# EAGLE design g5gate-min132 (EAGLE 9.6.2)
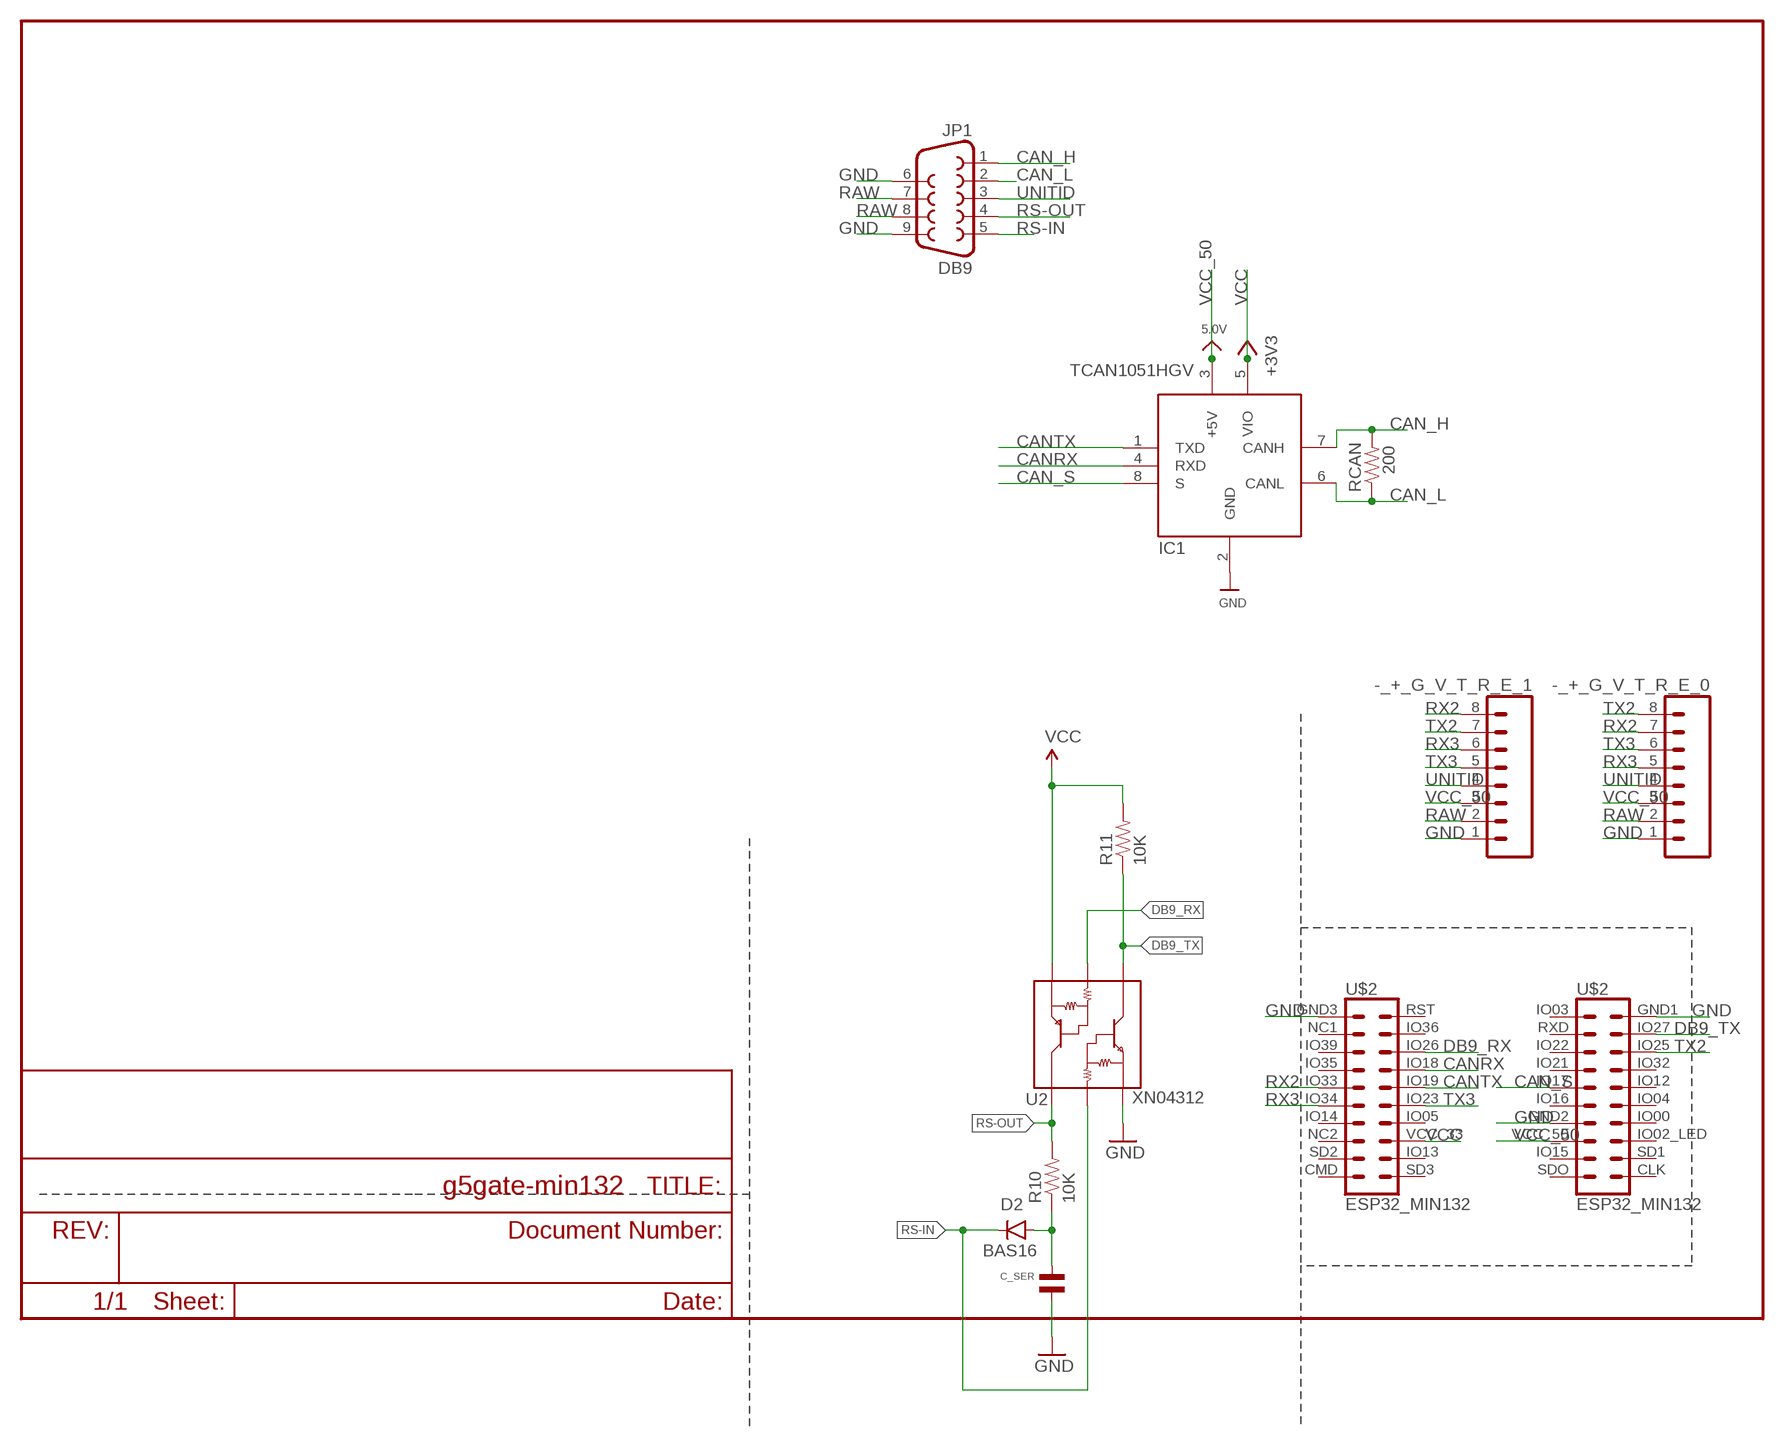
[diagram p0: schematic, sheet 1]

## Parts
-_+_G_V_T_R_E_0  MF-CON-2.54mm-01x08  M081X08  [1X08]
-_+_G_V_T_R_E_1  MF-CON-2.54mm-01x08  M081X08  [1X08]
C_SER  CAPACITOR_NP_0603  [C0603]
D2  BAS16  DIODEBAS16  [SOD-323]
IC1  TCAN1051HGV  CAN_TRANSCIEVER_TCAN1051V  [SOIC8_150MIL]
JP1  DB9  DB9FEMALE  [DB9]
R10  10K  10KOHM1/10W1%(0603)0603  [0603-RES]
R11  10K  10KOHM1/10W1%(0603)0603  [0603-RES]
RCAN  200  10KOHM1/10W1%(0603)0603  [0603-RES]
U2  XN04312  XN04312SOT  [SOT23-6]
U$2  ESP32_MIN132  [ESP32_MIN132]

## Nets
CAN_H: IC1.7(CANH) JP1.1 RCAN.2
CAN_L: IC1.6(CANL) JP1.2 RCAN.1
CAN_S: IC1.8(S) U$2.IO17
CANRX: IC1.4(RXD) U$2.IO18
CANTX: IC1.1(TXD) U$2.IO19
DB9_RX: U2.2(B2) U$2.IO26
DB9_TX: R11.1 U2.1(C1) U$2.IO27
GND [hc]: -_+_G_V_T_R_E_0.1 -_+_G_V_T_R_E_1.1 C_SER.P$2 IC1.2(GND) JP1.6 JP1.9 U2.6(E1) U$2.GND1 U$2.GND2 U$2.GND3
N$4: C_SER.P$1 D2.A R10.1
RAW: -_+_G_V_T_R_E_0.2 -_+_G_V_T_R_E_1.2 JP1.7 JP1.8
RS-IN: D2.C JP1.5 U2.5(B1)
RS-OUT: JP1.4 R10.2 U2.4(C2)
RX2: -_+_G_V_T_R_E_0.7 -_+_G_V_T_R_E_1.8 U$2.IO33
RX3: -_+_G_V_T_R_E_0.5 -_+_G_V_T_R_E_1.6 U$2.IO34
TX2: -_+_G_V_T_R_E_0.8 -_+_G_V_T_R_E_1.7 U$2.IO25
TX3: -_+_G_V_T_R_E_0.6 -_+_G_V_T_R_E_1.5 U$2.IO23
UNITID: -_+_G_V_T_R_E_0.4 -_+_G_V_T_R_E_1.4 JP1.3
VCC [hc]: IC1.5(VIO) R11.2 U2.3(E2) U$2.VCC_33 ; supply symbol labelled +3V3
VCC_50 [hc]: -_+_G_V_T_R_E_0.3 -_+_G_V_T_R_E_1.3 IC1.3(+5V) U$2.VCC_50 ; supply symbol labelled 5.0V
Unconnected: U$2.CLK U$2.CMD U$2.IO00 U$2.IO02_LED U$2.IO03 U$2.IO04 U$2.IO05 U$2.IO12 U$2.IO13 U$2.IO14 U$2.IO15 U$2.IO16 U$2.IO21 U$2.IO22 U$2.IO32 U$2.IO35 U$2.IO36 U$2.IO39 U$2.NC1 U$2.NC2 U$2.RST U$2.RXD U$2.SD1 U$2.SD2 U$2.SD3 U$2.SDO

## Library data of the parts
-_+_G_V_T_R_E_0 -_+_G_V_T_R_E_1 = SparkFun-Connectors:M08: Header 8 Standard 8-pin 0.1" header. Use with straight break away headers (SKU : PRT-00116), right angle break away headers (PRT-00553), swiss pins (PRT-00743), machine pins (PRT-00117), and female headers (PRT-00115).
C_SER = MF_Passives:CAPACITOR_NP: Library: MF_Passives Description: Device for Non-Polarized Capacitors. Manufacture part number (MPN) can be added via Attributes. Check https://factory.macrofab.com/parts for the house parts list.; POPULATE: 1
D2 = SparkFun-DiscreteSemi:DIODE: Diode These are standard reverse protection diodes and small signal diodes. SMA package can handle up to about 1A. SOD-323 can handle about 200mA. What the SOD-323 package when ordering, there are some mfgs out there that are 5-pin packages.; PROD_ID: DIO-09646; VALUE: 250mA/100V
IC1 = microbuilder:CAN_TRANSCIEVER
JP1 = SparkFun-Connectors:DB9: DB9 Connector Standard DB9 (D-Sub 9) serial connector. Can be used for CAN bus as well as RS485 and RS232. Footprint production proven. Spark Fun Electronics SKU : PRT-00429; PROD_ID: CONN-08194
R10 R11 = SparkFun-Resistors:10KOHM1/10W1%(0603): RES-00824; PROD_ID: RES-00824
RCAN = SparkFun-Resistors:10KOHM1/10W1%(0603): RES-00824; PROD_ID: RES-00824; VALUE: 10K
U2 = SparkFun-DiscreteSemi:XN04312: NPN/PNP Transistor Array Handy dandy transistor array for level shifting and inverting signals. Spark Fun Electronics SKU : COM-00588; PROD_ID: TRANS-00816
U$2 = 01jim:ESP32_MIN132

## Net classes
0 default: width 0.229 mm
1 vcc: width 0.254 mm
3 hc: width 0.254 mm

## Board
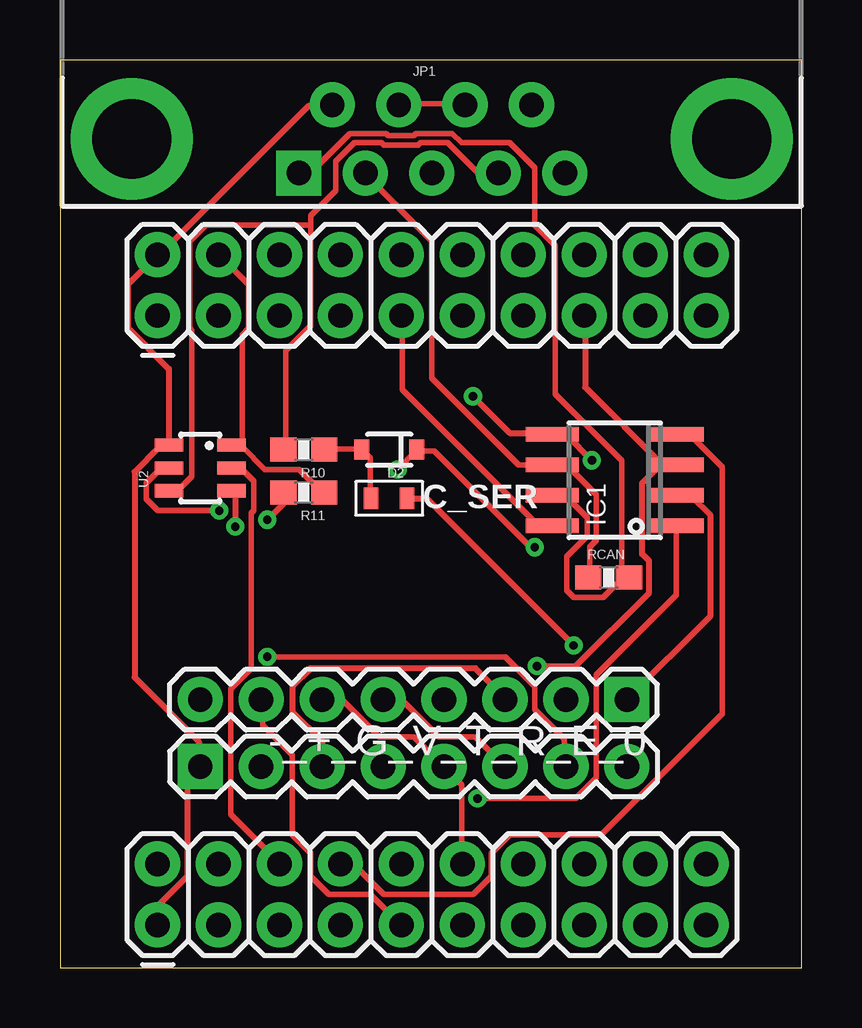
[diagram p1: board, top side]
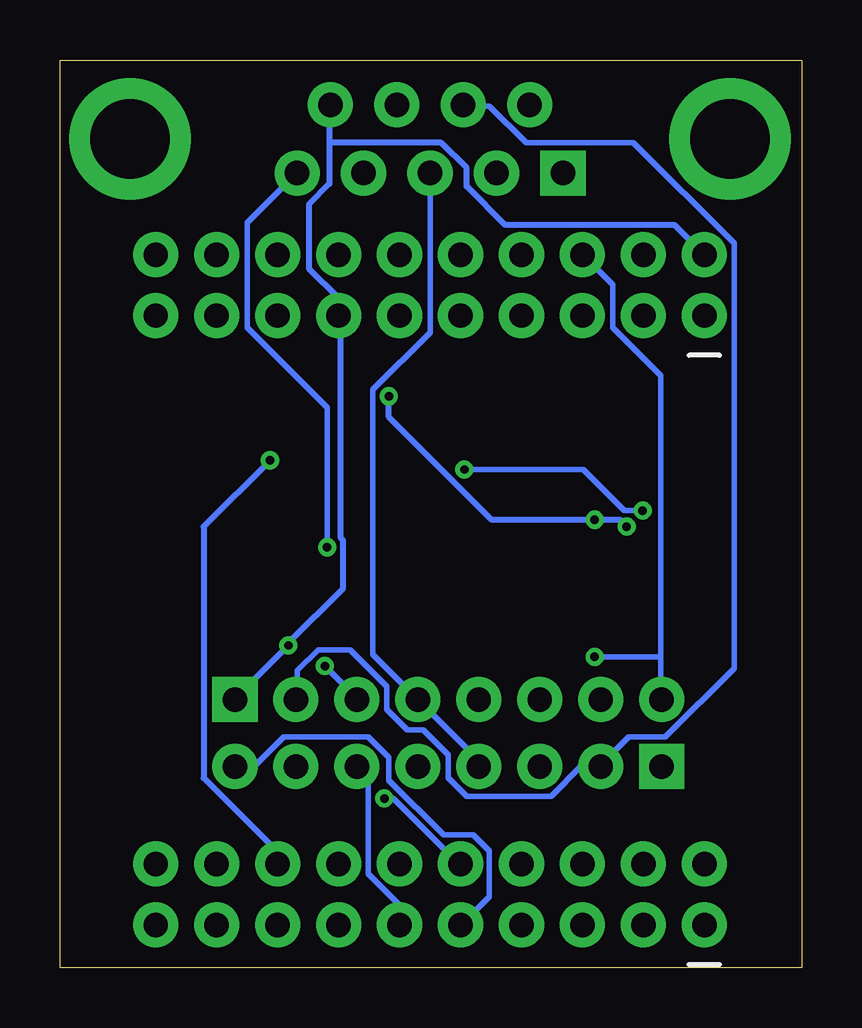
[diagram p2: board, bottom side, seen from below]

Size 30.91 x 37.84 mm. Coordinates in mm from the lower left corner, seen from the top.
Outline: 0,0 30.91,0 30.91,37.84 0,37.84 0,0
Copper layers (1*16): Top 0.035mm / dielectric 1.5mm / Bottom 0.035mm
Design rules "default *": minimum track width 6mil, minimum drill 0.35mm, track to track 6mil, track to pad 6mil, pad to pad 6mil, via to via 6mil, smd to smd 6mil, copper to edge 40mil, drill to drill 6mil, minimum pad ring 10mil, minimum via ring 8mil, stop-mask expansion 4mil, vias tented up to drill 30mil, thermal gap 10mil

### Footprints (pad centres in the part's own frame; a part is rotated, then mirrored left to right if it is on the bottom)
1X08 = drill 1.016 pad 1.88 square: 1 0,0 | drill 1.016 pad 1.88: 2 2.54,0; 3 5.08,0; 4 7.62,0; 5 10.16,0; 6 12.7,0; 7 15.24,0; 8 17.78,0
C0603 = smd 0.6 x 0.9: P$1 -0.75,0; P$2 0.75,0
SOD-323 = smd 0.63 x 0.83: A 1.15,0; C -1.15,0
SOIC8_150MIL = smd 0.6 x 2.2: 1 -1.905,-2.6; 2 -0.635,-2.6; 3 0.635,-2.6; 4 1.905,-2.6; 5 1.905,2.6; 6 0.635,2.6; 7 -0.635,2.6; 8 -1.905,2.6
DB9 = drill 1.016 pad 1.88 square: 1 -5.54,-1.42 | drill 1.016 pad 1.88: 2 -2.77,-1.42; 3 0,-1.42; 4 2.77,-1.42; 5 5.54,-1.42; 6 -4.15,1.42; 7 -1.38,1.42; 8 1.38,1.42; 9 4.15,1.42 | drill 3.302 pad 5.08: G1 -12.5,0; G2 12.5,0
0603-RES = smd 1.1 x 1: 1 -0.85,0; 2 0.85,0
SOT23-6 = smd 0.55 x 1.2: 1 0.95,-1.3; 2 0,-1.3; 3 -0.95,-1.3; 4 -0.95,1.3; 5 0,1.3; 6 0.95,1.3
ESP32_MIN132 = drill 1.016 pad 1.88: CLK 15.24,-22.86; CMD -12.7,-22.86; GND1 15.24,0; GND2 12.7,-15.24; GND3 -12.7,0; IO00 15.24,-15.24; IO02_LED 15.24,-17.78; IO03 12.7,0; IO04 15.24,-12.7; IO05 -10.16,-15.24; IO12 15.24,-10.16; IO13 -10.16,-20.32; IO14 -12.7,-15.24; IO15 12.7,-20.32; IO16 12.7,-12.7; IO17 12.7,-10.16; IO18 -10.16,-7.62; IO19 -10.16,-10.16; IO21 12.7,-7.62; IO22 12.7,-5.08; IO23 -10.16,-12.7; IO25 15.24,-5.08; IO26 -10.16,-5.08; IO27 15.24,-2.54; IO32 15.24,-7.62; IO33 -12.7,-10.16; IO34 -12.7,-12.7; IO35 -12.7,-7.62; IO36 -10.16,-2.54; IO39 -12.7,-5.08; NC1 -12.7,-2.54; NC2 -12.7,-17.78; RST -10.16,0; RXD 12.7,-2.54; SD1 15.24,-20.32; SD2 -12.7,-20.32; SD3 -10.16,-22.86; SDO 12.7,-22.86; VCC_33 -10.16,-17.78; VCC_50 12.7,-17.78

### Placement (x,y rotation side)
-_+_G_V_T_R_E_0  23.62,11.18 180 top
-_+_G_V_T_R_E_1  5.84,8.38 0 top
C_SER  13.72,19.56 0 top
D2  13.72,21.59 180 top
IC1  23.11,20.32 90 top
JP1  15.49,34.54 0 top
R10  10.16,21.59 180 top
R11  10.16,19.81 180 top
RCAN  22.86,16.26 0 top
U2  5.84,20.83 90 top
U$2  4.06,14.48 90 top

### Tracks (layer width: path | path; a pad name or v marks a point on that pad's centre or on a via)
CAN_H
  Top 0.229: IC1.7 20.54,19.62 21.11,19.62 21.97,18.76 21.97,18 21.11,17.14 21.11,15.72 21.4,15.43 22.64,15.43 23.4,16.19 23.69,16.19 RCAN.2 23.4,16.29 23.4,21.14 20.64,23.91 20.64,30.1 19.78,30.96 19.78,33.34 18.73,34.39 16.73,34.39 16.35,34.77 14.83,34.77 14.73,34.67 13.68,34.67 13.59,34.77 12.07,34.77 10.45,33.15 9.97,33.15 JP1.1
CAN_L
  Top 0.229: RCAN.1 22.07,16.29 22.07,17.53 22.35,17.81 22.35,19.72 21.11,20.96 IC1.6 19.11,20.96 15.49,24.57 15.49,30.29 12.73,33.05 JP1.2
CAN_S
  Top 0.229: IC1.8 20.45,18.48 19.88,18.48 14.26,24.1 14.26,27.15 U$2.IO17
CANRX
  Top 0.229: IC1.4 25.78,22.19 26.26,22.19 27.59,20.86 27.59,10.57 22.54,5.52 18.73,5.52 17.97,4.76 17.97,3.81 17.21,3.05 13.49,3.05 12.26,4.29 11.68,4.29 U$2.IO18
CANTX  (via drill 0.35)
  Top 0.229: v17.4,7.05 21.5,7.05 22.35,7.91 22.35,12.19 25.69,15.53 25.69,18.38 IC1.1
  Bottom 0.229: v17.4,7.05 17.02,7.05 14.26,4.29 U$2.IO19
DB9_RX
  Top 0.229: U2.2 7.21,20.76 7.59,20.76 8.07,20.29 8.07,19.05 7.97,18.96 7.97,12.48 7.11,11.62 7.11,6.38 9.11,4.38 U$2.IO26
DB9_TX
  Top 0.229: R11.1 10.92,19.81 9.97,20.76 8.54,20.76 7.59,21.72 7.21,21.72 U2.1 7.59,21.81 7.59,26.38 7.87,26.67 7.87,28.48 6.64,29.72 U$2.IO27
GND  (via drill 0.35)
  Top 0.254: v21.4,13.43 15.3,19.53 14.54,19.53 C_SER.P$2 | -_+_G_V_T_R_E_0.1 27.11,14.67 27.11,18.86 26.35,19.62 25.78,19.62 IC1.2 | U$2.GND3 4.06,2.57 5.3,3.81 5.3,7.91 5.78,8.38 -_+_G_V_T_R_E_1.1 5.78,8.48 5.78,9.43 3.11,12.1 3.11,20.67 4.16,21.72 4.45,21.72 U2.6 4.54,21.81 4.54,24.96 2.83,26.67 2.83,28.48 U$2.GND1 4.16,29.72 10.35,35.91 11.3,35.91 JP1.6
  Bottom 0.254: 19.68,34.39 19.68,35.91 JP1.9 | 19.68,34.39 19.68,32.67 20.54,31.81 20.54,29.15 19.3,27.91 U$2.GND2 19.21,27.15 19.21,17.91 19.11,17.81 19.11,15.81 21.4,13.52 v21.4,13.43 23.59,11.24 -_+_G_V_T_R_E_0.1 | 19.68,34.39 15.02,34.39 13.97,33.34 13.97,32.58 12.35,30.96 5.3,30.96 U$2.GND1
N$4
  Top 0.229: R10.1 11.02,21.62 12.54,21.62 D2.A 12.64,21.53 12.92,21.24 12.92,19.62 C_SER.P$1
RAW
  Top 0.229: JP1.7 14.16,36 16.83,36 JP1.8
  Bottom 0.229: -_+_G_V_T_R_E_0.2 21.02,11.24 21.02,12.38 20.16,13.24 18.83,13.24 17.3,11.72 17.3,10.76 16.45,9.91 15.78,9.91 14.73,8.86 14.73,7.91 13.97,7.14 10.45,7.14 9.21,8.38 -_+_G_V_T_R_E_1.2 8.35,8.48 7.21,9.62 5.68,9.62 2.83,12.48 2.83,30.19 7.02,34.39 11.49,34.39 13.02,35.91 14.07,35.91 JP1.7
RS-IN  (via drill 0.35)
  Top 0.229: v19.78,17.53 19.59,17.53 15.59,21.53 14.92,21.53 D2.C 14.83,21.53 v14.07,20.76 | v6.64,19.05 4.06,19.05 3.59,19.53 3.59,20.19 4.16,20.76 4.54,20.76 U2.5
  Bottom 0.229: v19.78,17.53 19.78,23.34 23.11,26.67 23.11,31.05 21.11,33.05 JP1.5 | v6.64,19.05 7.4,19.05 9.11,20.76 v14.07,20.76
RS-OUT
  Top 0.229: 10.45,30.96 10.45,31.34 11.49,32.39 11.49,33.62 12.26,34.39 13.4,34.39 13.49,34.29 14.92,34.29 15.02,34.39 16.16,34.39 17.4,33.15 18.26,33.15 JP1.4 | 10.45,30.96 10.45,26.76 9.4,25.72 9.4,21.62 R10.2 | 10.45,30.96 6.06,30.96 5.4,30.29 5.4,26.67 5.49,26.57 5.49,20.48 4.92,19.91 4.63,19.91 U2.4
RX2
  Top 0.229: -_+_G_V_T_R_E_0.7 8.45,11.14 8.45,10.1 9.68,8.86 9.68,5.52 10.45,4.76 10.45,3.81 11.21,3.05 12.92,3.05 14.16,1.81 U$2.IO33
  Bottom 0.229: -_+_G_V_T_R_E_1.8 22.83,8.38 21.59,9.62 18.07,9.62 17.21,8.76 17.21,7.81 14.92,5.52 13.68,5.52 13.02,4.86 13.02,2.95 14.16,1.81 U$2.IO33
RX3
  Top 0.229: -_+_G_V_T_R_E_1.6 17.3,9.62 15.78,9.62 14.26,11.14 13.49,11.14 -_+_G_V_T_R_E_0.5
  Bottom 0.229: -_+_G_V_T_R_E_1.6 18.07,7.91 18.07,3.9 16.83,2.67 16.83,1.81 U$2.IO34
TX2  (via drill 0.35)
  Top 0.229: v8.64,12.95 18.54,12.95 19.78,11.72 19.78,10.76 21.02,9.52 21.02,8.38 -_+_G_V_T_R_E_1.7
  Bottom 0.229: 5.87,12.95 5.87,24.67 7.87,26.67 7.87,28.48 9.11,29.72 U$2.IO25 | 5.87,12.95 5.87,11.24 -_+_G_V_T_R_E_0.8 | 5.87,12.95 v8.64,12.95
TX3
  Top 0.229: -_+_G_V_T_R_E_0.6 10.92,11.14 11.78,11.14 13.3,9.62 14.73,9.62 15.97,8.38 -_+_G_V_T_R_E_1.5 16.07,8.29 16.73,7.62 16.73,4.38 U$2.IO23
UNITID
  Bottom 0.229: -_+_G_V_T_R_E_1.4 13.49,8.38 13.49,8.67 -_+_G_V_T_R_E_0.4 17.88,13.05 17.88,24.1 15.49,26.48 JP1.3
VCC  (via drill 0.35)
  Top 0.254: v8.64,18.67 9.3,19.34 R11.2 | v7.3,18.38 7.3,19.72 7.21,19.81 U2.3 | v17.21,23.81 18.73,22.29 20.45,22.29 IC1.5 20.64,22.19 21.11,22.19 v22.16,21.14
  Bottom 0.254: v7.3,18.38 7.59,18.67 v8.64,18.67 12.92,18.67 17.21,22.96 v17.21,23.81 | v22.16,21.14 24.92,18.38 24.92,7.91 21.88,4.86 21.88,4.38 U$2.VCC_33
VCC_50  (via drill 0.35)
  Top 0.254: U$2.VCC_50 21.88,27.15 21.88,24.19 25.11,20.96 IC1.3 25.02,20.96 24.26,20.19 24.26,17.24 24.54,16.96 24.54,15.62 21.5,12.57 v19.88,12.57 | -_+_G_V_T_R_E_1.3 10.92,9.43 9.68,10.67 9.68,11.72 10.45,12.48 17.3,12.48 18.54,11.24 -_+_G_V_T_R_E_0.3
  Bottom 0.254: v19.88,12.57 18.54,11.24 -_+_G_V_T_R_E_0.3